# EAGLE design Balldetection (EAGLE 9.6.0)
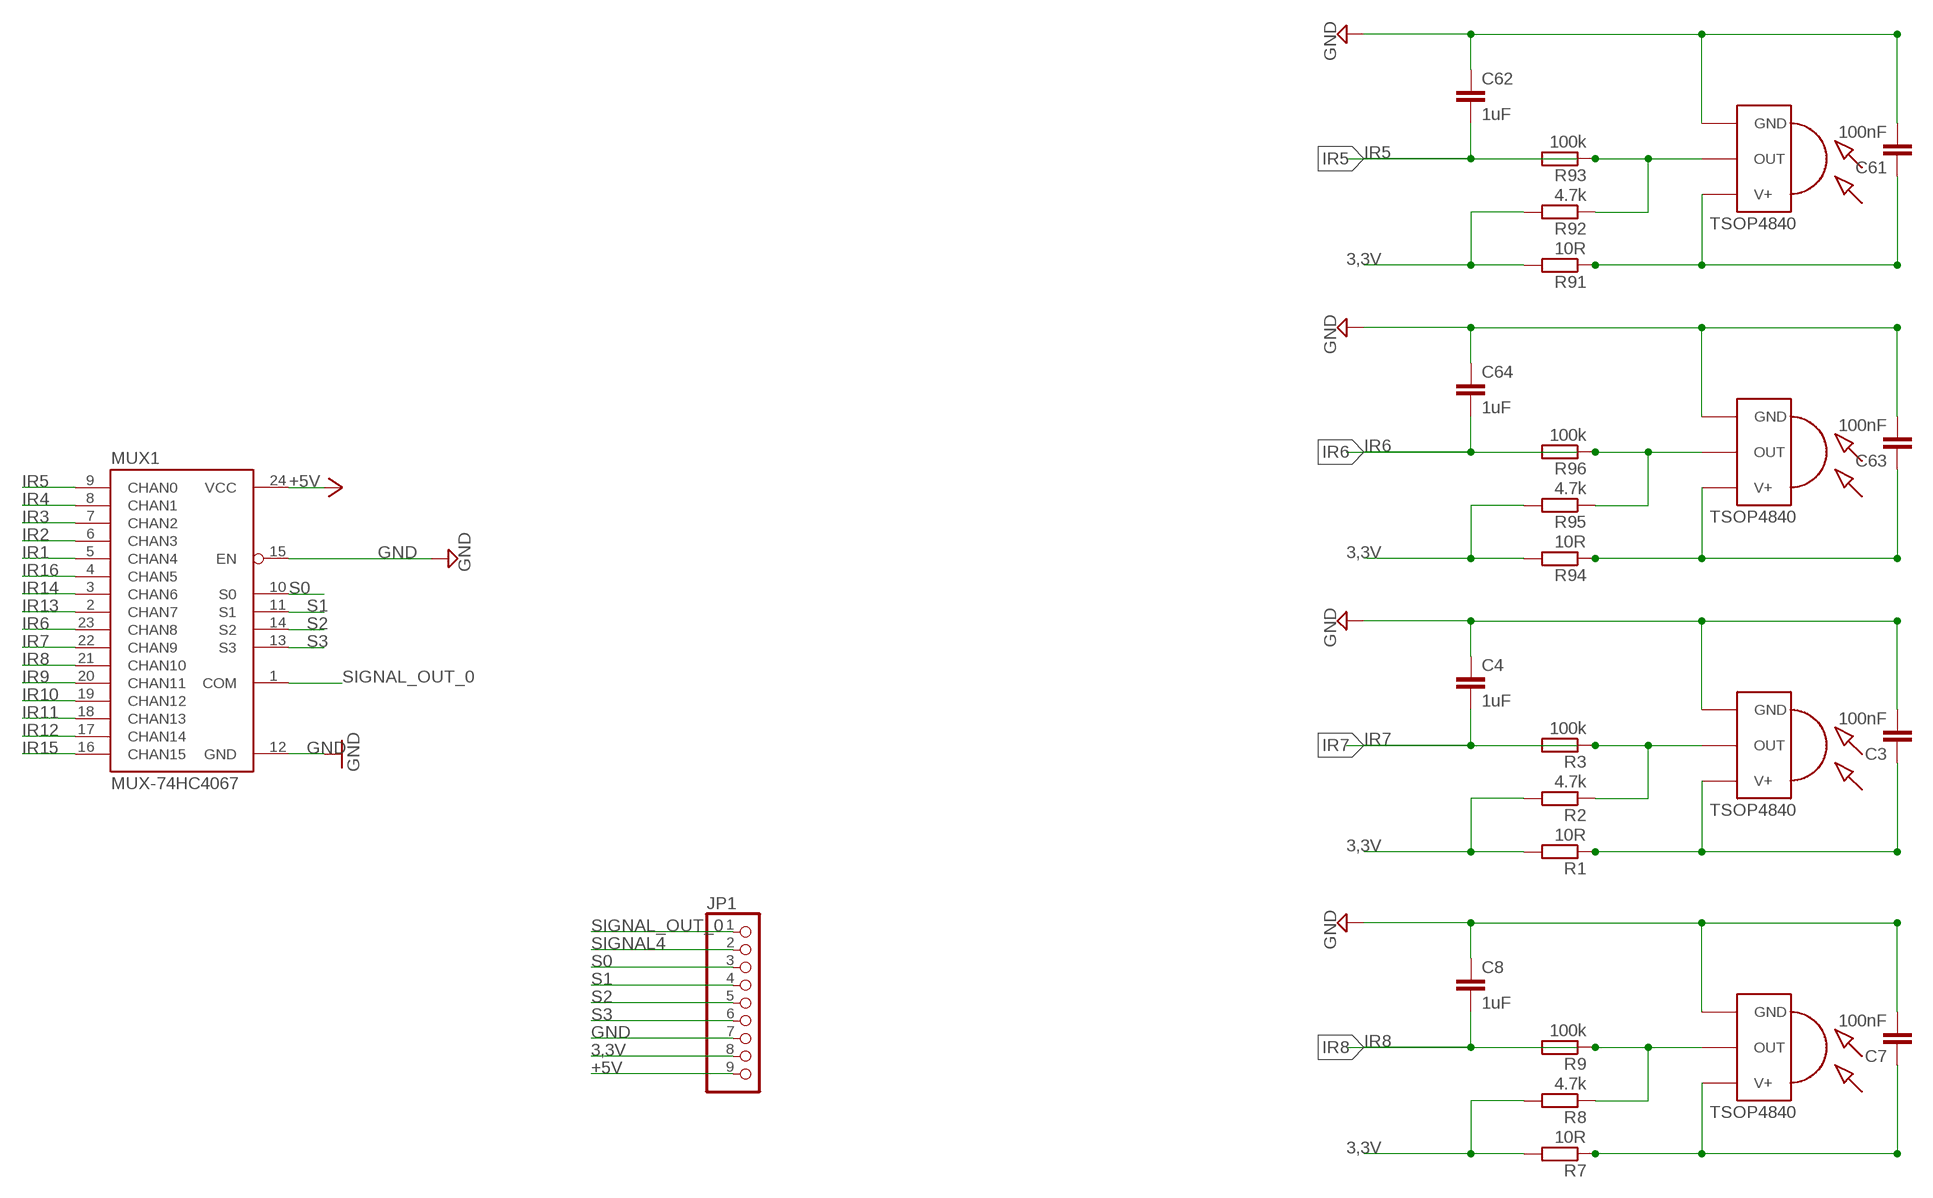
[diagram p0: schematic, sheet 1, part 1 of 2]
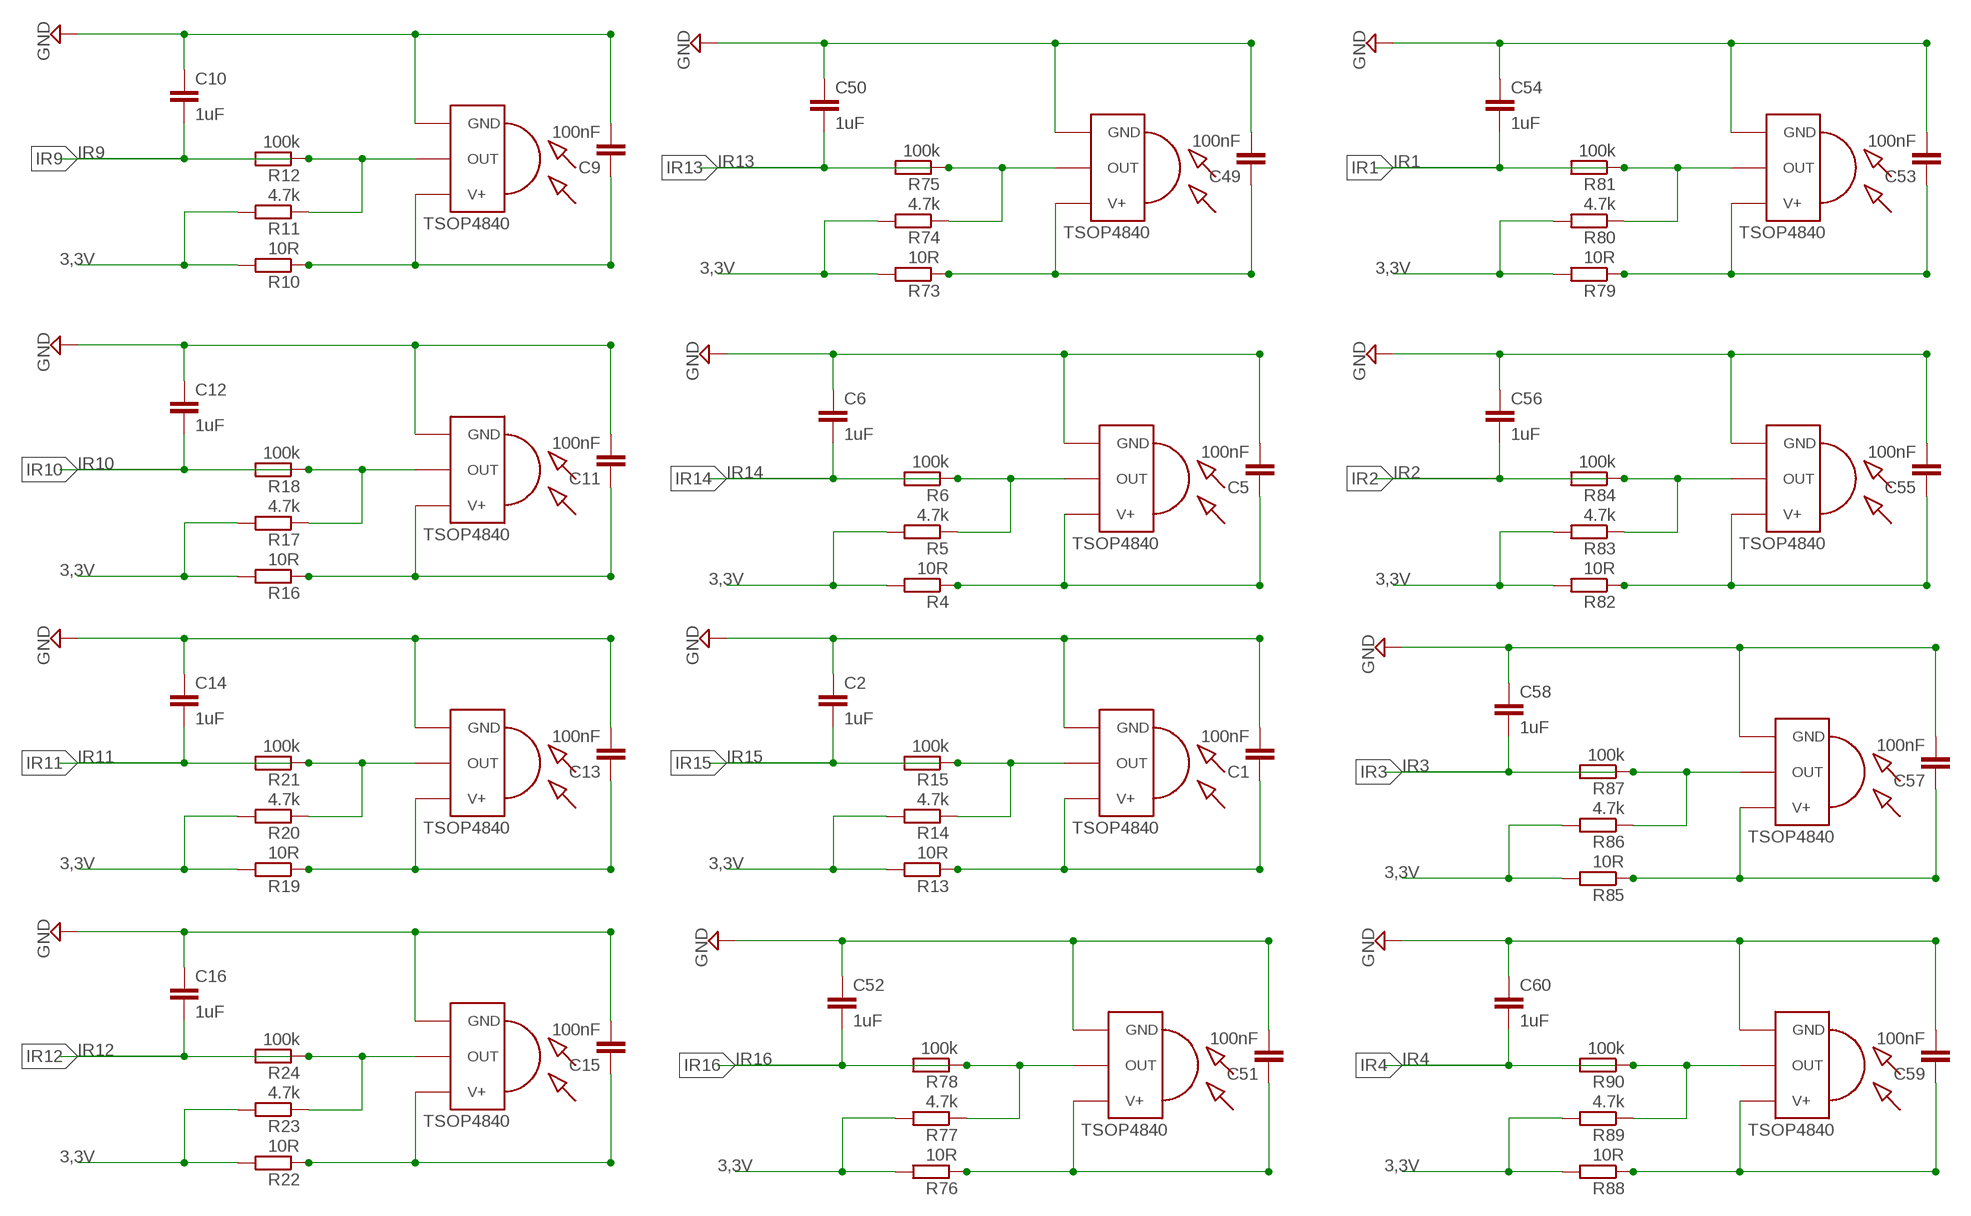
[diagram p1: schematic, sheet 1, part 2 of 2]

## Parts
C1  100nF  C-EUC1206  [C1206]
C2  1uF  C-EUC1206  [C1206]
C3  100nF  C-EUC1206  [C1206]
C4  1uF  C-EUC1206  [C1206]
C5  100nF  C-EUC1206  [C1206]
C6  1uF  C-EUC1206  [C1206]
C7  100nF  C-EUC1206  [C1206]
C8  1uF  C-EUC1206  [C1206]
C9  100nF  C-EUC1206  [C1206]
C10  1uF  C-EUC1206  [C1206]
C11  100nF  C-EUC1206  [C1206]
C12  1uF  C-EUC1206  [C1206]
C13  100nF  C-EUC1206  [C1206]
C14  1uF  C-EUC1206  [C1206]
C15  100nF  C-EUC1206  [C1206]
C16  1uF  C-EUC1206  [C1206]
C49  100nF  C-EUC1206  [C1206]
C50  1uF  C-EUC1206  [C1206]
C51  100nF  C-EUC1206  [C1206]
C52  1uF  C-EUC1206  [C1206]
C53  100nF  C-EUC1206  [C1206]
C54  1uF  C-EUC1206  [C1206]
C55  100nF  C-EUC1206  [C1206]
C56  1uF  C-EUC1206  [C1206]
C57  100nF  C-EUC1206  [C1206]
C58  1uF  C-EUC1206  [C1206]
C59  100nF  C-EUC1206  [C1206]
C60  1uF  C-EUC1206  [C1206]
C61  100nF  C-EUC1206  [C1206]
C62  1uF  C-EUC1206  [C1206]
C63  100nF  C-EUC1206  [C1206]
C64  1uF  C-EUC1206  [C1206]
IR1  TSOP4840  [TSOP18XX]
IR2  TSOP4840  [TSOP18XX]
IR3  TSOP4840  [TSOP18XX]
IR4  TSOP4840  [TSOP18XX]
IR5  TSOP4840  [TSOP18XX]
IR6  TSOP4840  [TSOP18XX]
IR7  TSOP4840  [TSOP18XX]
IR8  TSOP4840  [TSOP18XX]
IR9  TSOP4840  [TSOP18XX]
IR10  TSOP4840  [TSOP18XX]
IR11  TSOP4840  [TSOP18XX]
IR12  TSOP4840  [TSOP18XX]
IR13  TSOP4840  [TSOP18XX]
IR14  TSOP4840  [TSOP18XX]
IR15  TSOP4840  [TSOP18XX]
IR16  TSOP4840  [TSOP18XX]
JP1  PINHD-1X9  [1X09]
MUX1  MUX-74HC4067  MUX-74HC4067SMD  [SSOP24]
R1  10R  R-EU_R1206  [R1206]
R2  4.7k  R-EU_R1206  [R1206]
R3  100k  R-EU_R1206  [R1206]
R4  10R  R-EU_R1206  [R1206]
R5  4.7k  R-EU_R1206  [R1206]
R6  100k  R-EU_R1206  [R1206]
R7  10R  R-EU_R1206  [R1206]
R8  4.7k  R-EU_R1206  [R1206]
R9  100k  R-EU_R1206  [R1206]
R10  10R  R-EU_R1206  [R1206]
R11  4.7k  R-EU_R1206  [R1206]
R12  100k  R-EU_R1206  [R1206]
R13  10R  R-EU_R1206  [R1206]
R14  4.7k  R-EU_R1206  [R1206]
R15  100k  R-EU_R1206  [R1206]
R16  10R  R-EU_R1206  [R1206]
R17  4.7k  R-EU_R1206  [R1206]
R18  100k  R-EU_R1206  [R1206]
R19  10R  R-EU_R1206  [R1206]
R20  4.7k  R-EU_R1206  [R1206]
R21  100k  R-EU_R1206  [R1206]
R22  10R  R-EU_R1206  [R1206]
R23  4.7k  R-EU_R1206  [R1206]
R24  100k  R-EU_R1206  [R1206]
R73  10R  R-EU_R1206  [R1206]
R74  4.7k  R-EU_R1206  [R1206]
R75  100k  R-EU_R1206  [R1206]
R76  10R  R-EU_R1206  [R1206]
R77  4.7k  R-EU_R1206  [R1206]
R78  100k  R-EU_R1206  [R1206]
R79  10R  R-EU_R1206  [R1206]
R80  4.7k  R-EU_R1206  [R1206]
R81  100k  R-EU_R1206  [R1206]
R82  10R  R-EU_R1206  [R1206]
R83  4.7k  R-EU_R1206  [R1206]
R84  100k  R-EU_R1206  [R1206]
R85  10R  R-EU_R1206  [R1206]
R86  4.7k  R-EU_R1206  [R1206]
R87  100k  R-EU_R1206  [R1206]
R88  10R  R-EU_R1206  [R1206]
R89  4.7k  R-EU_R1206  [R1206]
R90  100k  R-EU_R1206  [R1206]
R91  10R  R-EU_R1206  [R1206]
R92  4.7k  R-EU_R1206  [R1206]
R93  100k  R-EU_R1206  [R1206]
R94  10R  R-EU_R1206  [R1206]
R95  4.7k  R-EU_R1206  [R1206]
R96  100k  R-EU_R1206  [R1206]

## Nets
3,3V: JP1.8 R1.2 R2.2 R4.2 R5.2 R7.2 R8.2 R10.2 R11.2 R13.2 R14.2 R16.2 R17.2 R19.2 R20.2 R22.2 R23.2 R73.2 R74.2 R76.2 R77.2 R79.2 R80.2 R82.2 R83.2 R85.2 R86.2 R88.2 R89.2 R91.2 R92.2 R94.2 R95.2
+5V: JP1.9 MUX1.24(VCC)
GND: C1.2 C2.1 C3.2 C4.1 C5.2 C6.1 C7.2 C8.1 C9.2 C10.1 C11.2 C12.1 C13.2 C14.1 C15.2 C16.1 C49.2 C50.1 C51.2 C52.1 C53.2 C54.1 C55.2 C56.1 C57.2 C58.1 C59.2 C60.1 C61.2 C62.1 C63.2 C64.1 IR1.GND IR2.GND IR3.GND IR4.GND IR5.GND IR6.GND IR7.GND IR8.GND IR9.GND IR10.GND IR11.GND IR12.GND IR13.GND IR14.GND IR15.GND IR16.GND JP1.7 MUX1.12(GND) MUX1.15(EN)
IR1: C54.2 MUX1.5(CHAN4) R81.2
IR2: C56.2 MUX1.6(CHAN3) R84.2
IR3: C58.2 MUX1.7(CHAN2) R87.2
IR4: C60.2 MUX1.8(CHAN1) R90.2
IR5: C62.2 MUX1.9(CHAN0) R93.2
IR6: C64.2 MUX1.23(CHAN8) R96.2
IR7: C4.2 MUX1.22(CHAN9) R3.2
IR8: C8.2 MUX1.21(CHAN10) R9.2
IR9: C10.2 MUX1.20(CHAN11) R12.2
IR10: C12.2 MUX1.19(CHAN12) R18.2
IR11: C14.2 MUX1.18(CHAN13) R21.2
IR12: C16.2 MUX1.17(CHAN14) R24.2
IR13: C50.2 MUX1.2(CHAN7) R75.2
IR14: C6.2 MUX1.3(CHAN6) R6.2
IR15: C2.2 MUX1.16(CHAN15) R15.2
IR16: C52.2 MUX1.4(CHAN5) R78.2
N$1: C3.1 IR15.VCC(V+) R1.1
N$2: IR15.OUT R2.1 R3.1
N$3: C5.1 IR8.VCC(V+) R4.1
N$4: IR8.OUT R5.1 R6.1
N$5: C7.1 IR14.VCC(V+) R7.1
N$6: C1.1 IR7.VCC(V+) R13.1
N$7: IR14.OUT R8.1 R9.1
N$8: C9.1 IR13.VCC(V+) R10.1
N$9: IR13.OUT R11.1 R12.1
N$10: C11.1 IR12.VCC(V+) R16.1
N$11: IR12.OUT R17.1 R18.1
N$12: C13.1 IR11.VCC(V+) R19.1
N$13: IR11.OUT R20.1 R21.1
N$14: C15.1 IR10.VCC(V+) R22.1
N$15: IR10.OUT R23.1 R24.1
N$43: IR7.OUT R14.1 R15.1
N$49: C49.1 IR9.VCC(V+) R73.1
N$50: IR9.OUT R74.1 R75.1
N$51: C51.1 IR6.VCC(V+) R76.1
N$52: IR6.OUT R77.1 R78.1
N$53: C53.1 IR5.VCC(V+) R79.1
N$54: IR5.OUT R80.1 R81.1
N$55: C55.1 IR4.VCC(V+) R82.1
N$56: IR4.OUT R83.1 R84.1
N$57: C57.1 IR3.VCC(V+) R85.1
N$58: IR3.OUT R86.1 R87.1
N$59: C59.1 IR2.VCC(V+) R88.1
N$60: IR2.OUT R89.1 R90.1
N$61: C61.1 IR1.VCC(V+) R91.1
N$62: IR1.OUT R92.1 R93.1
N$63: C63.1 IR16.VCC(V+) R94.1
N$64: IR16.OUT R95.1 R96.1
S0: JP1.3 MUX1.10(S0)
S1: JP1.4 MUX1.11(S1)
S2: JP1.5 MUX1.14(S2)
S3: JP1.6 MUX1.13(S3)
SIGNAL4: JP1.2
SIGNAL_OUT_0: JP1.1 MUX1.1(COM)

## Library data of the parts
C1-C16 C49-C64 = rcl:C-EU: CAPACITOR, European symbol
IR1-IR16 = tsop-1:TSOP4840: IR Receiver and Demodulator
JP1 = pinhead:PINHD-1X9: PIN HEADER
MUX1 = SparkFun:MUX-74HC4067
R1-R24 R73-R96 = rcl:R-EU_: RESISTOR, European symbol

## Board
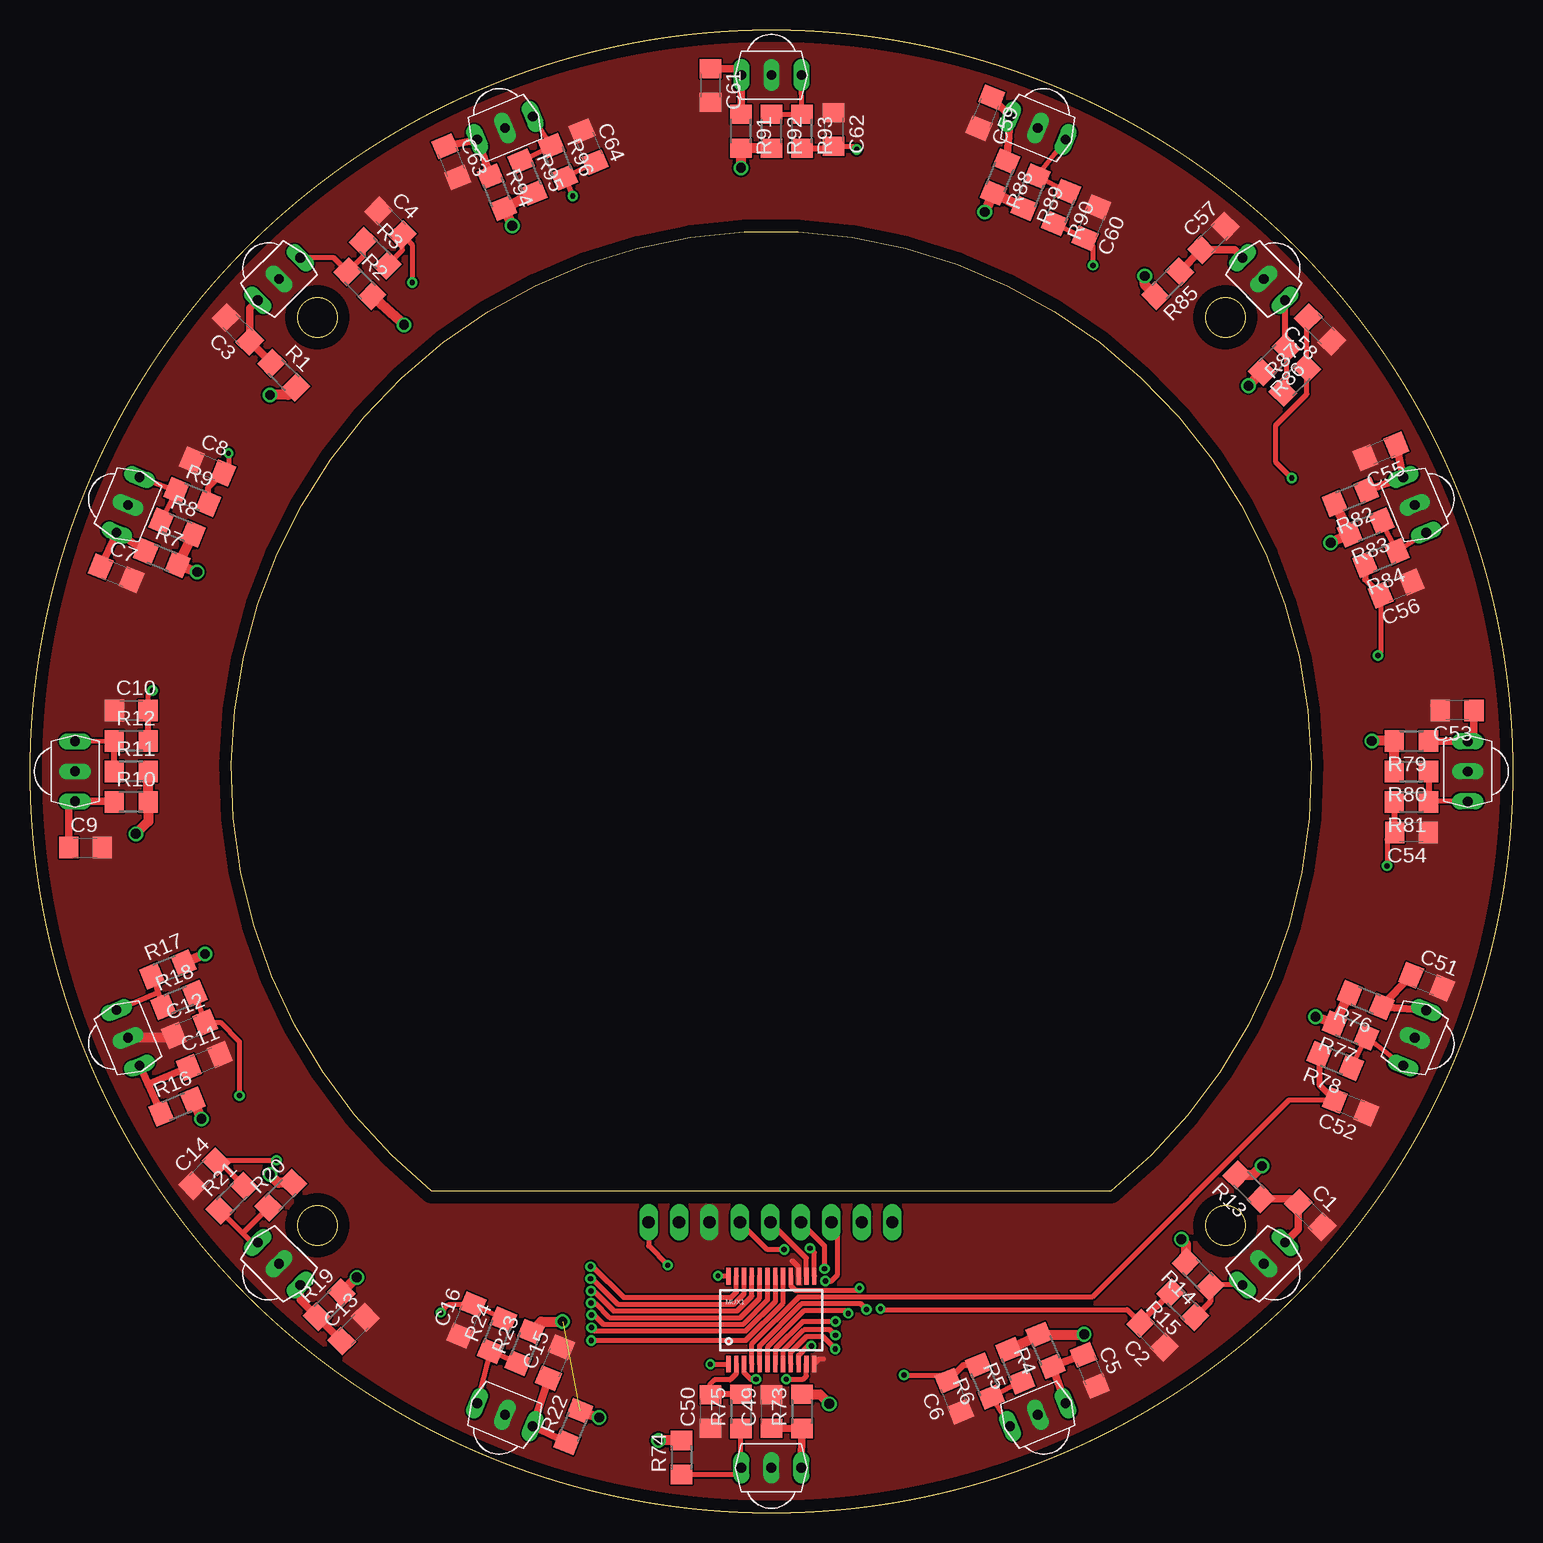
[diagram p2: board, top side]
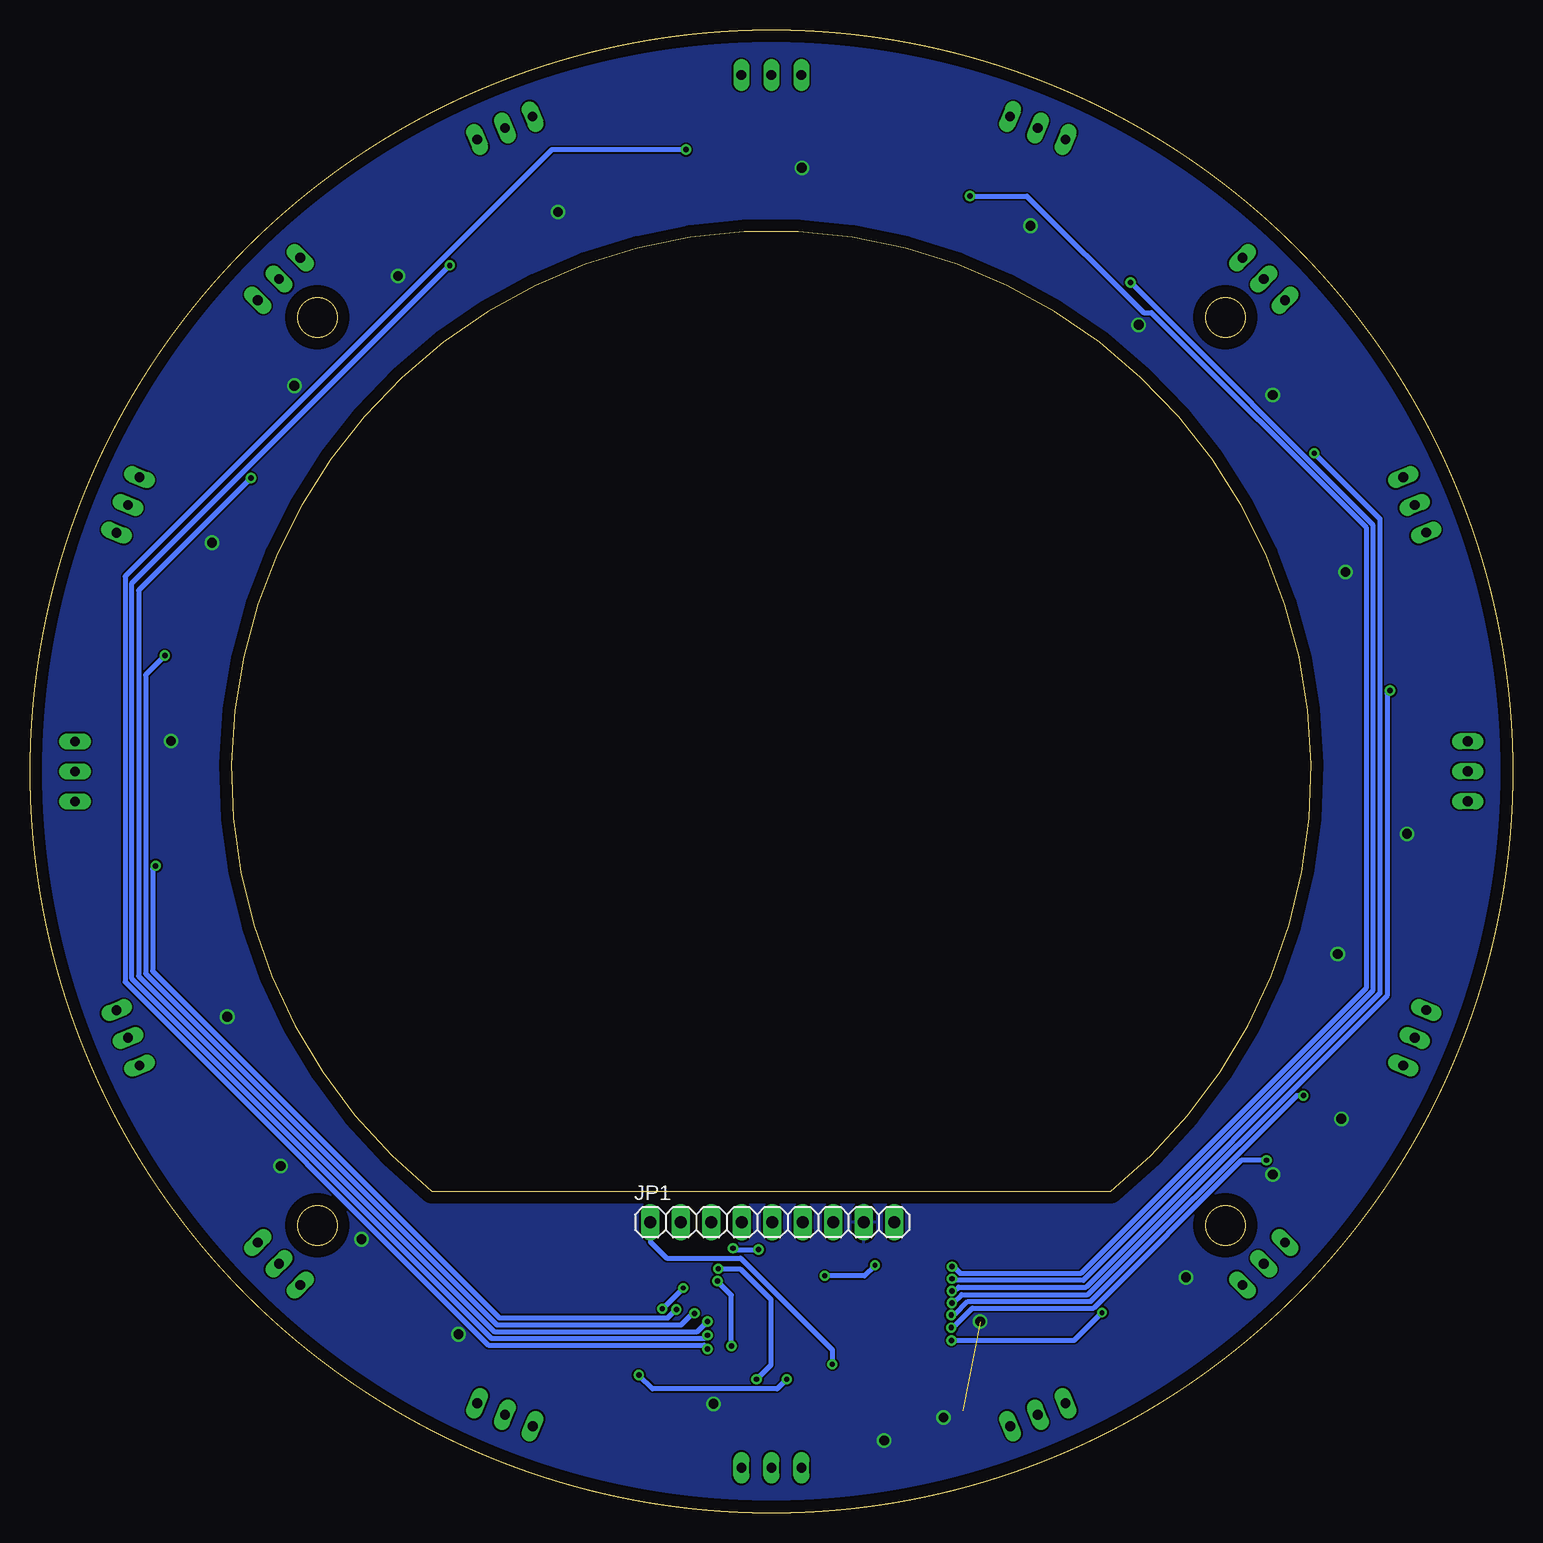
[diagram p3: board, bottom side, seen from below]

Size 123.56 x 123.56 mm. Coordinates in mm from the lower left corner, seen from the top.
Outline: 90.07,26.78 33.5,26.78 arc-282 90.07,26.78
Outline: circle at 61.78,61.78 radius 61.78
Outline: circle at 23.95,23.95 radius 1.65
Outline: circle at 99.61,23.95 radius 1.65
Outline: circle at 23.95,99.61 radius 1.65
Outline: circle at 99.61,99.61 radius 1.65
Copper layers (1*16): Top 0.035mm / dielectric 1.5mm / Bottom 0.035mm
Design rules "default": minimum track width 6mil, minimum drill 0.35mm, track to track 6mil, track to pad 6mil, pad to pad 6mil, via to via 6mil, smd to smd 6mil, copper to edge 40mil, drill to drill 6mil, minimum pad ring 10mil, minimum via ring 8mil, stop-mask expansion 4mil, vias tented up to drill 0mil, thermal gap 10mil

### Footprints (pad centres in the part's own frame; a part is rotated, then mirrored left to right if it is on the bottom)
C1206 = smd 1.6 x 1.8: 1 -1.4,0; 2 1.4,0
TSOP18XX = drill 0.813 long: GND -0.001,-0.027; OUT -2.501,-0.027; VCC 2.499,-0.027
1X09 = drill 1.016 long: 1 -10.16,0; 2 -7.62,0; 3 -5.08,0; 4 -2.54,0; 5 0,0; 6 2.54,0; 7 5.08,0; 8 7.62,0; 9 10.16,0
SSOP24 = smd 0.348 x 1.397: 1 -3.575,-3.656; 2 -2.925,-3.656; 3 -2.275,-3.656; 4 -1.625,-3.656; 5 -0.975,-3.656; 6 -0.325,-3.656; 7 0.325,-3.656; 8 0.975,-3.656; 9 1.625,-3.656; 10 2.275,-3.656; 11 2.925,-3.656; 12 3.575,-3.656; 13 3.575,3.656; 14 2.925,3.656; 15 2.275,3.656; 16 1.625,3.656; 17 0.975,3.656; 18 0.325,3.656; 19 -0.325,3.656; 20 -0.975,3.656; 21 -1.625,3.656; 22 -2.275,3.656; 23 -2.925,3.656; 24 -3.575,3.656
R1206 = smd 1.6 x 1.803: 1 -1.422,0; 2 1.422,0

### Placement (x,y rotation side)
C1  106.69,24.82 315 top
C2  93.53,14.79 135 top
C3  17.33,98.61 135 top
C4  30.03,107.5 315 top
C5  88.32,11.87 292.5 top
C6  77.02,9.71 112.5 top
C7  7.17,78.29 337.5 top
C8  14.79,87.18 337.5 top
C9  4.63,55.43 0 top
C10  8.44,66.86 0 top
C11  14.54,37.65 22.5 top
C12  13.29,40.32 22.5 top
C13  26.96,15.3 45 top
C14  14.54,28.25 45 top
C15  43.75,12.51 67.5 top
C16  36.38,16.06 67.5 top
C49  61.78,8.44 90 top
C50  56.7,8.44 90 top
C51  116.39,44.26 337.5 top
C52  110.04,33.84 157.5 top
C53  118.93,66.86 180 top
C54  115.12,56.7 180 top
C55  112.58,88.45 202.5 top
C56  113.85,77.02 202.5 top
C57  98.61,106.23 45 top
C58  107.5,98.61 135 top
C59  79.61,116.67 247.5 top
C60  88.45,107.5 247.5 top
C61  56.7,118.93 270 top
C62  66.96,115.27 270 top
C63  35.11,112.58 292.5 top
C64  46.54,113.85 292.5 top
IR1  61.78,119.78 180 top
IR2  83.98,115.37 157.5 top
IR3  102.79,102.79 135 top
IR4  115.37,83.98 112.5 top
IR5  119.78,61.78 90 top
IR6  115.37,39.59 67.5 top
IR7  102.79,20.77 45 top
IR8  83.98,8.2 22.5 top
IR9  61.78,3.78 0 top
IR10  39.59,8.2 337.5 top
IR11  20.77,20.77 315 top
IR12  8.2,39.59 292.5 top
IR13  3.78,61.78 270 top
IR14  8.2,83.98 247.5 top
IR15  20.77,102.79 225 top
IR16  39.59,115.37 202.5 top
JP1  61.7,24.21 0 bottom
MUX1  61.78,16.06 0 top
R1  21.14,94.8 315 top
R2  27.49,102.42 315 top
R3  28.76,104.96 315 top
R4  84.64,13.52 112.5 top
R5  82.1,12.25 112.5 top
R6  79.56,10.98 112.5 top
R7  10.98,79.56 337.5 top
R8  12.25,82.1 337.5 top
R9  13.52,84.64 337.5 top
R10  8.44,59.24 0 top
R11  8.44,61.78 0 top
R12  8.44,64.32 0 top
R13  101.58,27.16 135 top
R14  97.34,19.87 135 top
R15  96.07,17.33 135 top
R16  12.25,33.84 22.5 top
R17  11.49,45.27 22.5 top
R18  12.4,42.73 22.5 top
R19  24.95,17.33 45 top
R20  20.89,26.48 45 top
R21  16.82,26.22 45 top
R22  45.27,7.17 67.5 top
R23  41.21,13.78 67.5 top
R24  38.92,14.79 67.5 top
R73  64.32,8.44 90 top
R74  54.29,4.61 90 top
R75  59.24,8.44 90 top
R76  111.31,42.73 157.5 top
R77  110.04,40.19 157.5 top
R78  108.77,37.65 157.5 top
R79  115.12,64.32 180 top
R80  115.12,61.78 180 top
R81  115.12,59.24 180 top
R82  110.04,84.64 202.5 top
R83  111.31,82.1 202.5 top
R84  112.58,79.56 202.5 top
R85  94.8,102.42 225 top
R86  103.69,96.07 225 top
R87  105.39,94.37 45 top
R88  80.83,111.31 247.5 top
R89  83.37,110.04 247.5 top
R90  85.91,108.77 247.5 top
R91  59.24,115.12 270 top
R92  61.78,115.12 270 top
R93  64.32,115.12 270 top
R94  38.92,110.04 292.5 top
R95  41.46,111.31 292.5 top
R96  44,112.58 292.5 top

### Tracks (layer width: path | path; a pad name or v marks a point on that pad's centre or on a via)
3,3V  (via drill 0.81)  (1 unrouted)
  Top 0.813: v8.82,56.57 9.86,57.62 R10.2 R11.2 | R16.2 v14.28,32.83 | R19.2 v27.24,19.62 | R20.2 20.7,27.48 v20,28.18 | R73.2 65.82,9.86 v66.61,9.08 | R74.2 v52.38,6.03 | v52.38,6.03 | R22.2 v47.43,7.93 | R5.2 R4.2 87.8,14.84 v87.85,14.88 | R14.2 96.34,22.4 v95.94,22.79 | R13.2 101.95,28.17 v102.68,28.89 | R76.2 R77.2 v107.12,41.33 | R80.2 R79.2 v111.82,64.32 | R82.2 R83.2 v108.39,80.83 | R85.2 92.9,102.32 v92.9,103.06 | R86.2 v101.53,93.91 | R89.2 R88.2 v79.56,108.39 | R92.2 R91.2 v59.24,112.07 | R95.2 R94.2 v40.19,107.25 | R2.2 v31.17,98.99 | R1.2 21.5,93.15 v20,93.15 | R8.2 R7.2 v13.93,78.39 | R23.2 42.6,15.93 v44.38,15.93 | R17.2 v14.59,46.57
  pour Bottom: -7.69,85.15 -7.69,18.47 12.38,-1.59 117.53,-1.59 133.28,14.16 133.28,115.12 121.85,126.55 7.68,126.55 -5.78,113.09 -7.69,111.18
+5V  (via drill 0.41)
  Top 0.406: JP1.9 51.55,22.23 v53.15,20.63 | v57.34,19.74 58.18,19.74 MUX1.24
  Bottom 0.406: v53.15,20.63 54.03,19.74 v57.34,19.74
GND
  Top 0.406: MUX1.15 64.06,20.45 63.51,21 | MUX1.12 65.77,12.82 66.14,12.82
  Top 0.838: C54.1 116.55,56.73 | C53.2 117.1,67.29 | C55.2 110.96,87.92 | C62.1 66.99,116.7 | C12.1 11.79,39.58 IR12.GND | 56.75,7.04 C50.1
  pour Top (no thermals): 13.78,151.19 87.94,151.19 127.06,112.07 133.66,105.47 133.66,11.24 109.53,-12.89 7.17,-12.89 -20.01,14.28 -20.01,111.57 -20.01,117.41
IR1  (via drill 0.45)
  Top 0.406: v69.7,16.95 69.25,17.4 64.28,17.4 60.81,13.93 MUX1.5 | C54.2 113.67,56.7 113.09,56.12 v113.09,53.91
  Top 0.508: R81.2 113.7,56.72 C54.2
  Bottom 0.406: v69.7,16.95 70.41,16.24 84.45,16.24 113.34,45.13 113.34,53.65 v113.09,53.91
IR2  (via drill 0.45)
  Top 0.406: C56.2 112.56,71.66 v112.33,71.43 | v68.19,16.62 67.98,16.82 64.49,16.82 61.46,13.79 MUX1.6
  Top 0.508: R84.2 111.27,77.78 C56.2
  Bottom 0.406: v112.33,71.43 113.93,69.83 113.93,44.92 84.66,15.66 69.31,15.66 68.35,16.62 v68.19,16.62
IR3  (via drill 0.45)
  Top 0.406: MUX1.7 62.11,13.65 64.39,15.93 v67.12,15.93 | v105.15,86.23 103.82,87.56 103.82,90.64 106.4,93.22 R87.2 106.4,99.49 C58.2
  Bottom 0.406: v105.15,86.23 114.51,76.86 114.51,44.72 84.89,15.1 67.95,15.1 v67.12,15.93
IR4  (via drill 0.45)
  Top 0.406: v88.58,103.95 88.58,105.54 C60.2 R90.2 | MUX1.8 62.76,13.51 64.5,15.25 66.66,15.25 v67.12,14.79
  Bottom 0.406: v88.58,103.95 115.07,77.46 115.07,44.48 85.12,14.54 67.37,14.54 v67.12,14.79
IR5  (via drill 0.45)
  Top 0.406: C62.2 68.62,113.87 v68.89,113.6 | MUX1.9 63.41,13.37 64.73,14.69 66.07,14.69 v67.11,13.66
  Top 0.508: R93.2 66.79,113.7 C62.2
  Bottom 0.406: v68.89,113.6 80.07,113.6 115.63,78.04 115.63,44.23 85.36,13.96 67.41,13.96 v67.11,13.66
IR6  (via drill 0.45)
  Top 0.406: v46.72,20.51 46.91,20.51 49.48,17.94 58.43,17.94 58.86,18.37 MUX1.23 | C64.2 R96.2 v45.23,109.72
  Bottom 0.406: v45.23,109.72 40.48,109.72 30.77,100.01 30.12,100.01 12.23,82.11 12.23,43.71 36.01,19.92 46.01,19.92 46.59,20.51 v46.72,20.51
IR7  (via drill 0.45)
  Top 0.406: R3.2 31.02,105.21 C4.2 31.85,105.68 v31.85,102.53 | v46.72,19.5 46.85,19.5 48.96,17.38 58.66,17.38 59.51,18.23 MUX1.22
  Bottom 0.406: v46.72,19.5 46.59,19.36 35.78,19.36 11.67,43.48 11.67,82.34 v31.85,102.53
IR8  (via drill 0.41, 0.45)
  Top 0.406: v46.74,18.49 46.97,18.49 48.63,16.82 58.94,16.82 60.16,18.04 MUX1.21 | v16.54,88.3 16.54,87.11 C8.2
  Top 0.508: R9.2 14.84,85.4 C8.2
  Bottom 0.406: v46.74,18.49 46.49,18.49 46.17,18.8 35.55,18.8 11.08,43.27 11.08,82.84 v16.54,88.3
IR9  (via drill 0.45)
  Top 0.406: C10.2 9.84,68.13 v10.22,68.51 | v46.74,17.48 47.06,17.48 48.27,16.26 59.19,16.26 60.81,17.88 MUX1.20
  Top 0.508: R12.2 9.86,66.84 C10.2
  Bottom 0.406: v10.22,68.51 10.47,68.26 10.47,43.09 35.4,18.17 45.93,18.17 46.62,17.48 v46.74,17.48
IR10  (via drill 0.45)
  Top 0.406: v46.79,16.47 46.8,16.46 47.03,16.46 47.79,15.71 59.42,15.71 61.46,17.74 MUX1.19 | R18.2 C12.2 15.86,40.85 17.45,39.26 v17.45,34.76
  Bottom 0.406: v17.45,34.76 18.02,34.76 35.17,17.61 45.4,17.61 46.54,16.47 v46.79,16.47
IR11  (via drill 0.45)
  Top 0.406: C14.2 15.66,29.37 v20.53,29.37 | v46.79,15.42 46.79,15.41 47.05,15.15 59.65,15.15 62.11,17.6 MUX1.18
  Top 0.508: R21.2 15.81,29.24 C14.2
  Bottom 0.406: v20.53,29.37 22.61,29.37 34.93,17.05 45.03,17.05 46.66,15.42 v46.79,15.42
IR12  (via drill 0.41, 0.45)
  Top 0.406: MUX1.17 62.76,17.46 59.66,14.36 v46.77,14.36 | R24.2 C16.2 34.91,17.35 v34.23,16.68
  Bottom 0.406: v34.23,16.68 36.55,14.36 v46.77,14.36
IR13
  Top 0.406: C50.2 56.7,10.75 56.88,10.93 57.03,11.08 58.35,11.08 58.86,11.59 MUX1.2
  Top 0.508: R75.2 56.72,9.86 C50.2
IR14  (via drill 0.45)
  Top 0.406: v72.83,11.47 76.02,11.47 C6.2 | v60.5,11.13 60.47,11.1 60.09,11.1 59.51,11.68 MUX1.3
  Top 0.508: R6.2 77.78,12.3 C6.2
  Bottom 0.406: v72.83,11.47 71.68,10.32 61.31,10.32 v60.5,11.13
IR15  (via drill 0.41)
  Top 0.406: MUX1.16 63.41,18.9 63.78,18.53 68.92,18.53 v69.12,18.73 | v70.87,17 70.95,16.93 91.43,16.93 92.54,15.81
  Top 0.508: R15.2 92.54,15.81 C2.2
  Bottom 0.406: v69.12,18.73 70.85,17 v70.87,17
IR16
  Top 0.406: MUX1.4 60.16,14.07 64.05,17.97 88.5,17.97 104.91,34.38 C52.2
  Top 0.508: R78.2 107.46,35.67 C52.2
N$1
  Top 0.61: IR15.VCC 18.32,100.38 C3.1 R1.1
N$2
  Top 0.406: IR15.OUT 25.33,104.58 R2.1 27.76,104.7 R3.1
N$3
  Top 0.61: IR8.VCC R4.1 C5.1
N$4
  Top 0.406: IR8.OUT R6.1 R5.1
N$5
  Top 0.61: R7.1 IR14.VCC C7.1
N$6
  Top 0.61: IR7.VCC 105.7,23.64 C1.1 105.36,26.16 R13.1
N$7
  Top 0.406: R8.1 R9.1 IR14.OUT
N$8
  Top 0.508: 3.23,55.45 C9.1
  Top 0.61: R10.1 6.98,59.28 IR13.VCC 3.23,58.76 3.23,55.45
N$9
  Top 0.406: IR13.OUT R12.1
  Top 0.508: R11.1 R12.1
N$10
  Top 0.61: IR12.VCC 9.85,35.69 | 9.85,35.69 R16.1 | C11.1 9.85,35.69
N$11
  Top 0.406: R17.1 10.67,43.35 | 10.67,43.35 R18.1 | 10.67,43.35 IR12.OUT
N$12
  Top 0.61: C13.1 R19.1 22.52,17.75 IR11.VCC
  Top 0.838: C13.1
N$13
  Top 0.406: R21.1 17.72,23.31 | 17.72,23.31 18.51,22.52 IR11.OUT | R20.1 17.72,23.31
N$14
  Top 0.61: R22.1 IR10.VCC C15.1
N$15
  Top 0.406: IR10.OUT R24.1 R23.1
N$43
  Top 0.406: IR7.OUT 98.46,18.98 R14.1
  Top 0.508: R14.1 98.35,17.6 R15.1
N$49
  Top 0.61: IR9.VCC R73.1 C49.1
N$50
  Top 0.406: R75.1 59.24,3.79 IR9.OUT 58.71,3.18 R74.1
N$51
  Top 0.61: IR6.VCC R76.1 C51.1
N$52
  Top 0.406: R78.1 R77.1 IR6.OUT
N$53
  Top 0.61: C53.1 120.33,64.8 IR5.VCC 116.58,64.28 R79.1
N$54
  Top 0.406: IR5.OUT 116.58,59.28 R81.1
  Top 0.508: R80.1 R81.1
N$55
  Top 0.61: R82.1 IR4.VCC C55.1
N$56
  Top 0.406: IR4.OUT R84.1 R83.1
N$57
  Top 0.61: IR3.VCC 100.38,105.24 C57.1 R85.1
N$58
  Top 0.406: R86.1 104.7,93.67 R87.1
  Top 0.508: IR3.OUT 104.58,97.19 R86.1 104.7,96.82
N$59
  Top 0.61: C59.1 IR2.VCC R88.1
N$60
  Top 0.406: IR2.OUT R89.1 R90.1
N$61
  Top 0.61: C61.1 58.76,120.33 IR1.VCC 59.28,116.58 R91.1
N$62
  Top 0.406: IR1.OUT R93.1 R92.1
N$63
  Top 0.61: C63.1 IR16.VCC R94.1
N$64
  Top 0.406: IR16.OUT R96.1 R95.1
S0  (via drill 0.45)
  Top 0.406: v65.11,13.91 64.83,13.91 64.06,13.13 MUX1.10 | v66.28,19.31 66.79,19.31 67.27,19.79 67.27,23.73 JP1.3
  Bottom 0.406: v65.11,13.91 65.11,18.14 v66.28,19.31
S1  (via drill 0.45)
  Top 0.406: JP1.4 66.2,22.26 v66.2,20.33 | v63.02,11.13 64.44,11.13 64.71,11.39 MUX1.11
  Bottom 0.406: v66.2,20.33 64.39,20.33 61.83,17.77 61.83,12.31 v63.02,11.13
S2
  Top 0.406: MUX1.14 64.71,21.21 JP1.5
S3  (via drill 0.45)
  Top 0.406: MUX1.13 65.36,21.67 v64.99,22.04 | v62.85,21.93 61.45,21.93 JP1.6
  Bottom 0.406: v64.99,22.04 64.88,21.93 v62.85,21.93
SIGNAL_OUT_0  (via drill 0.41)
  Top 0.406: v56.7,12.38 58.18,12.38 MUX1.1
  Bottom 0.406: JP1.1 71.87,22.56 70.52,21.22 64.35,21.22 56.7,13.57 v56.7,12.38